# EAGLE schematic Versorgungseinheit_v2_old (EAGLE 6.5.0)
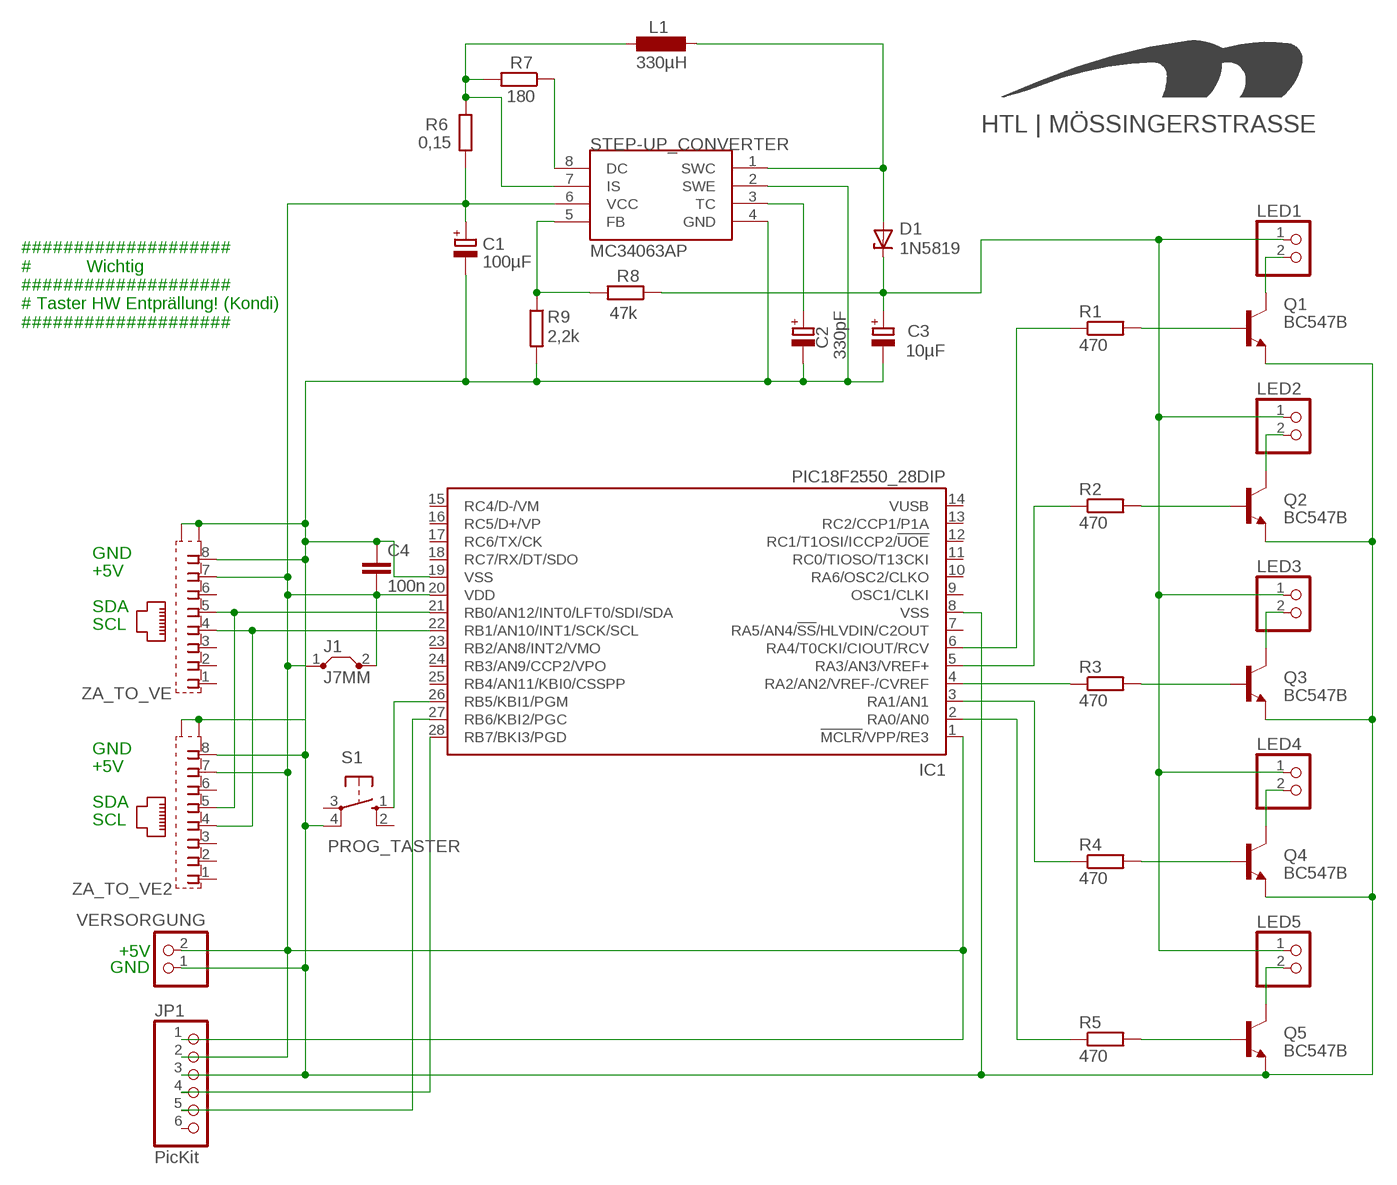
[diagram p0: schematic, sheet 1]

## Parts
C1  100µF  CPOL-EUE5-8.5  [E5-8,5]
C2  330pF  CPOL-EUE5-8.5  [E5-8,5]
C3  10µF  CPOL-EUE5-8.5  [E5-8,5]
C4  100n  C-EU050-025X075  [C050-025X075]
D1  1N5819  1N4728  [DO41Z10]
IC1  PIC18F2550_28DIP  [DIL28-3]
J1  J7MM  [07]
JP1  PicKit  PINHD-1X6  [1X06]
L1  330µH  L-EU0204/5  [0204/5]
LED1  PINHD-1X2  [1X02]
LED2  PINHD-1X2  [1X02]
LED3  PINHD-1X2  [1X02]
LED4  PINHD-1X2  [1X02]
LED5  PINHD-1X2  [1X02]
Q1  BC547B  [TO92]
Q2  BC547B  [TO92]
Q3  BC547B  [TO92]
Q4  BC547B  [TO92]
Q5  BC547B  [TO92]
R1  470  R-EU_0207/10  [0207/10]
R2  470  R-EU_0207/10  [0207/10]
R3  470  R-EU_0207/10  [0207/10]
R4  470  R-EU_0207/10  [0207/10]
R5  470  R-EU_0207/10  [0207/10]
R6  0,15  R-EU_R1206  [R1206]
R7  180  R-EU_0207/10  [0207/10]
R8  47k  R-EU_0207/10  [0207/10]
R9  2,2k  R-EU_0207/10  [0207/10]
S1  PROG_TASTER  10-XX  [B3F-10XX]
STEP-UP_CONVERTER  MC34063AP  [DIL08]
U$2  HTL_LOGOBOT_15MM  [LOGOBOT_15]
VERSORGUNG  PINHD-1X2  [1X02]
ZA_TO_VE  555141-1  [555153-1]
ZA_TO_VE2  555141-1  [555153-1]

## Nets
N$1: IC1.2(RA0/AN0) R5.1
N$2: IC1.3(RA1/AN1) R4.1
N$3: IC1.6(RA4/T0CKI/CIOUT/RCV) R1.1
N$4: IC1.4(RA2/AN2/VREF-/CVREF) R3.1
N$5: C3.+ D1.C LED1.1 LED2.1 LED3.1 LED4.1 LED5.1 R8.1
N$6: IC1.26(RB5/KBI1/PGM) S1.1(S)
N$7: IC1.5(RA3/AN3/VREF+) R2.1
N$8: IC1.22(RB1/AN10/INT1/SCK/SCL) ZA_TO_VE2.4 ZA_TO_VE.4
N$9: Q1.2(B) R1.2
N$10: Q2.2(B) R2.2
N$11: Q3.2(B) R3.2
N$12: Q4.2(B) R4.2
N$13: Q5.2(B) R5.2
N$14: LED1.2 Q1.3(C)
N$15: LED2.2 Q2.3(C)
N$16: LED3.2 Q3.3(C)
N$17: LED4.2 Q4.3(C)
N$18: LED5.2 Q5.3(C)
N$19: L1.2 R6.2 R7.2 STEP-UP_CONVERTER.7(IS)
N$20: R7.1 STEP-UP_CONVERTER.8(DC)
N$21: D1.A L1.1 STEP-UP_CONVERTER.1(SWC)
N$22: R8.2 R9.1 STEP-UP_CONVERTER.5(FB)
N$23: C2.+ STEP-UP_CONVERTER.3(TC)
N$24: IC1.28(RB7/BKI3/PGD) JP1.4
N$25: IC1.27(RB6/KBI2/PGC) JP1.5
SDA: IC1.21(RB0/AN12/INT0/LFT0/SDI/SDA) ZA_TO_VE2.5 ZA_TO_VE.5
VDD: C1.+ C4.2 IC1.1(!MCLR!/VPP/RE3) IC1.20(VDD) J1.1 J1.2 JP1.1 JP1.2 R6.1 STEP-UP_CONVERTER.6(VCC) VERSORGUNG.2 ZA_TO_VE2.7 ZA_TO_VE.7
VSS: C1.- C2.- C3.- C4.1 IC1.8(VSS) IC1.19(VSS) JP1.3 Q1.1(E) Q2.1(E) Q3.1(E) Q4.1(E) Q5.1(E) R9.2 S1.4(P1) STEP-UP_CONVERTER.2(SWE) STEP-UP_CONVERTER.4(GND) VERSORGUNG.1 ZA_TO_VE2.8 ZA_TO_VE2.G1(S1) ZA_TO_VE2.G2(S2) ZA_TO_VE.8 ZA_TO_VE.G1(S1) ZA_TO_VE.G2(S2)
Unconnected: IC1.7(RA5/AN4/!SS!/HLVDIN/C2OUT) IC1.9(OSC1/CLKI) IC1.10(RA6/OSC2/CLKO) IC1.11(RC0/TIOSO/T13CKI) IC1.12(RC1/T1OSI/ICCP2/!UOE) IC1.13(RC2/CCP1/P1A) IC1.14(VUSB) IC1.15(RC4/D-/VM) IC1.16(RC5/D+/VP) IC1.17(RC6/TX/CK) IC1.18(RC7/RX/DT/SDO) IC1.23(RB2/AN8/INT2/VMO) IC1.24(RB3/AN9/CCP2/VPO) IC1.25(RB4/AN11/KBI0/CSSPP) JP1.6 S1.2(S1) S1.3(P) ZA_TO_VE2.1 ZA_TO_VE2.2 ZA_TO_VE2.3 ZA_TO_VE2.6 ZA_TO_VE.1 ZA_TO_VE.2 ZA_TO_VE.3 ZA_TO_VE.6

## Notes on the sheet
- ####################
  #           Wichtig
  ####################
  # Taster HW Entprällung! (Kondi)
  ####################
- GND
- +5V
- SDA
- SCL
- GND
- +5V
- SDA
- SCL
- +5V
- GND

## Library data of the parts
C1-C3 = resistor:CPOL-EU: POLARIZED CAPACITOR, European symbol
C4 = resistor:C-EU: CAPACITOR, European symbol
D1 = diode:1N4728: Z DIODE 3.3 V, 1W, 5 percent
IC1 = microchip:PIC18F2*_28: USB Microcontrollers with nanoWatt Technology High-Performance, Enhanced Flash, 28/40/44-Pin, Source: http://ww1.microchip.com/downloads/en/devicedoc/39632c.pdf; MF: MICROCHIP; MPN: PIC18F2550-I/SP; OC_FARNELL: 1523822; OC_NEWARK: 80K6054
J1 = jumper:J: Bridge
JP1 = pinhead:PINHD-1X6: PIN HEADER
L1 = resistor:L-EU: INDUCTOR, European symbol
LED1-LED5 VERSORGUNG = pinhead:PINHD-1X2: PIN HEADER
Q1-Q5 = transistor-npn:BC547*: NPN Transistor
R1-R9 = resistor:R-EU_: RESISTOR, European symbol
S1 = switch-omron:10-XX: OMRON SWITCH; MPN: B3F-1000; OC_FARNELL: 176432; OC_NEWARK: 36M3542
STEP-UP_CONVERTER = mc34063:MC34063
U$2 = HTL-Logo:HTL_LOGO
ZA_TO_VE ZA_TO_VE2 = con-amp:555141-1: AMP connector